# Altium schematic sheet 27. CPLD.SchDoc: CPLD (part 1 of 2)
size 513 x 386 mm; Project: PROC154E2(001)_SK_AM69; Issue: 1.0; RevCode: E3; Page Create Date: March  8, 1995; Variant Name: Core Design; Schematic Page Number: 27; Page Number: 27; Page Size: C; Comment: MISTRAL_TITLEBLK_CSIZE_1; Page Count: 62; Schematic Page Count: 62; Name: PROC154E2 001 SK AM69; DsnPath: C:\Users\danie\Downloads\sprr466c\PROC154E3_RP\PROC154E3_SCH.DSN; SchematicName: SCHEMATIC1; PageName: 27. CPLD; PageSize: C; TopSchematic: True
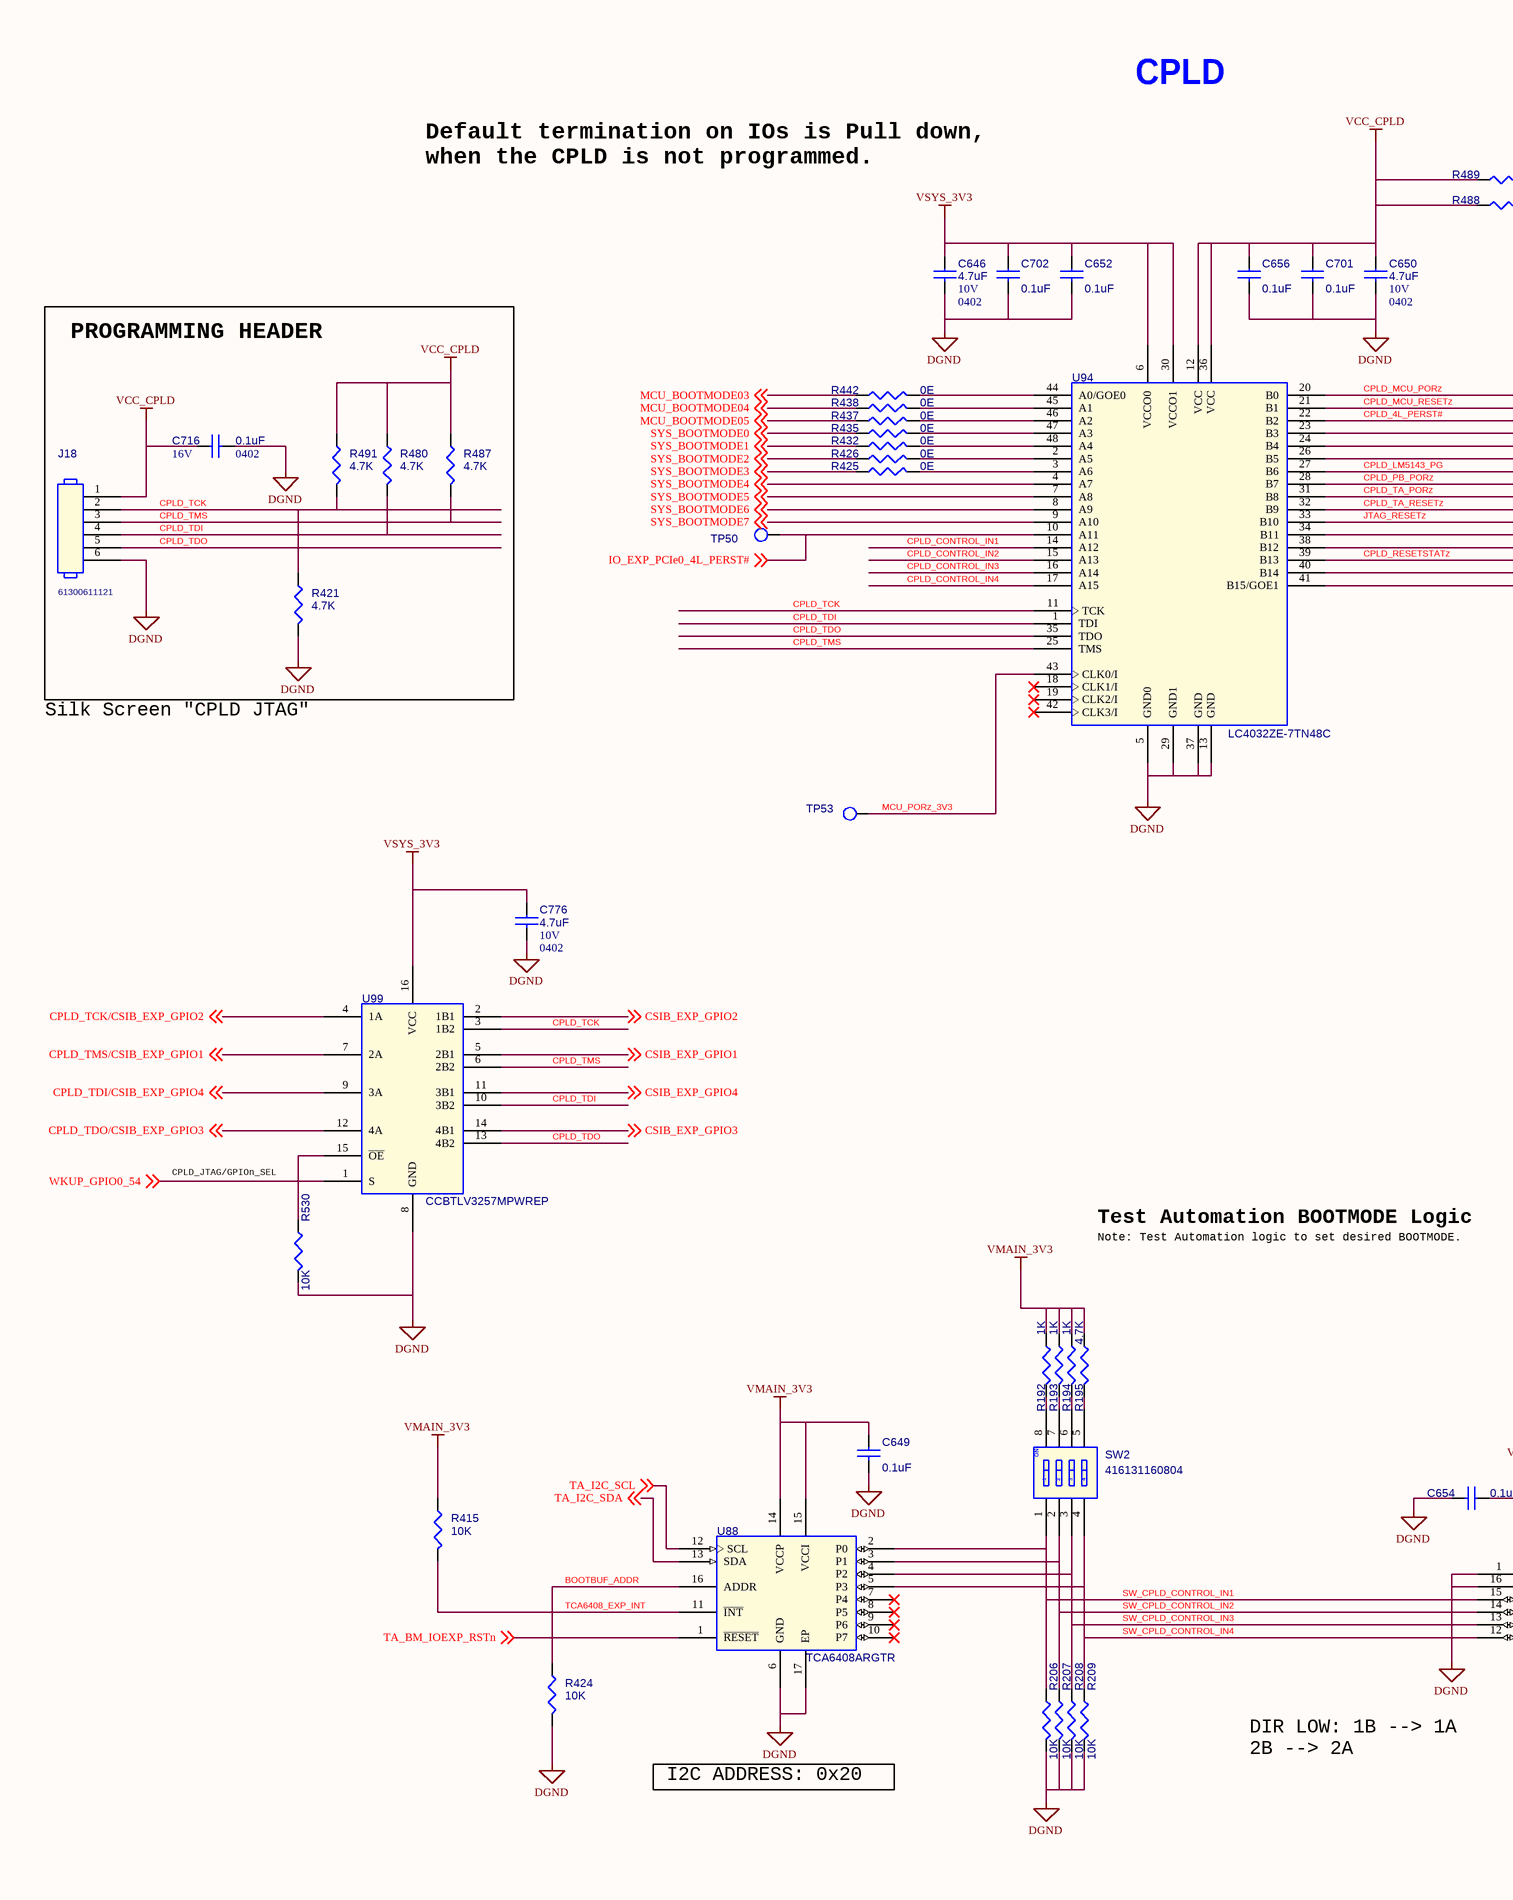
[diagram p0: 27. CPLD.SchDoc, left]
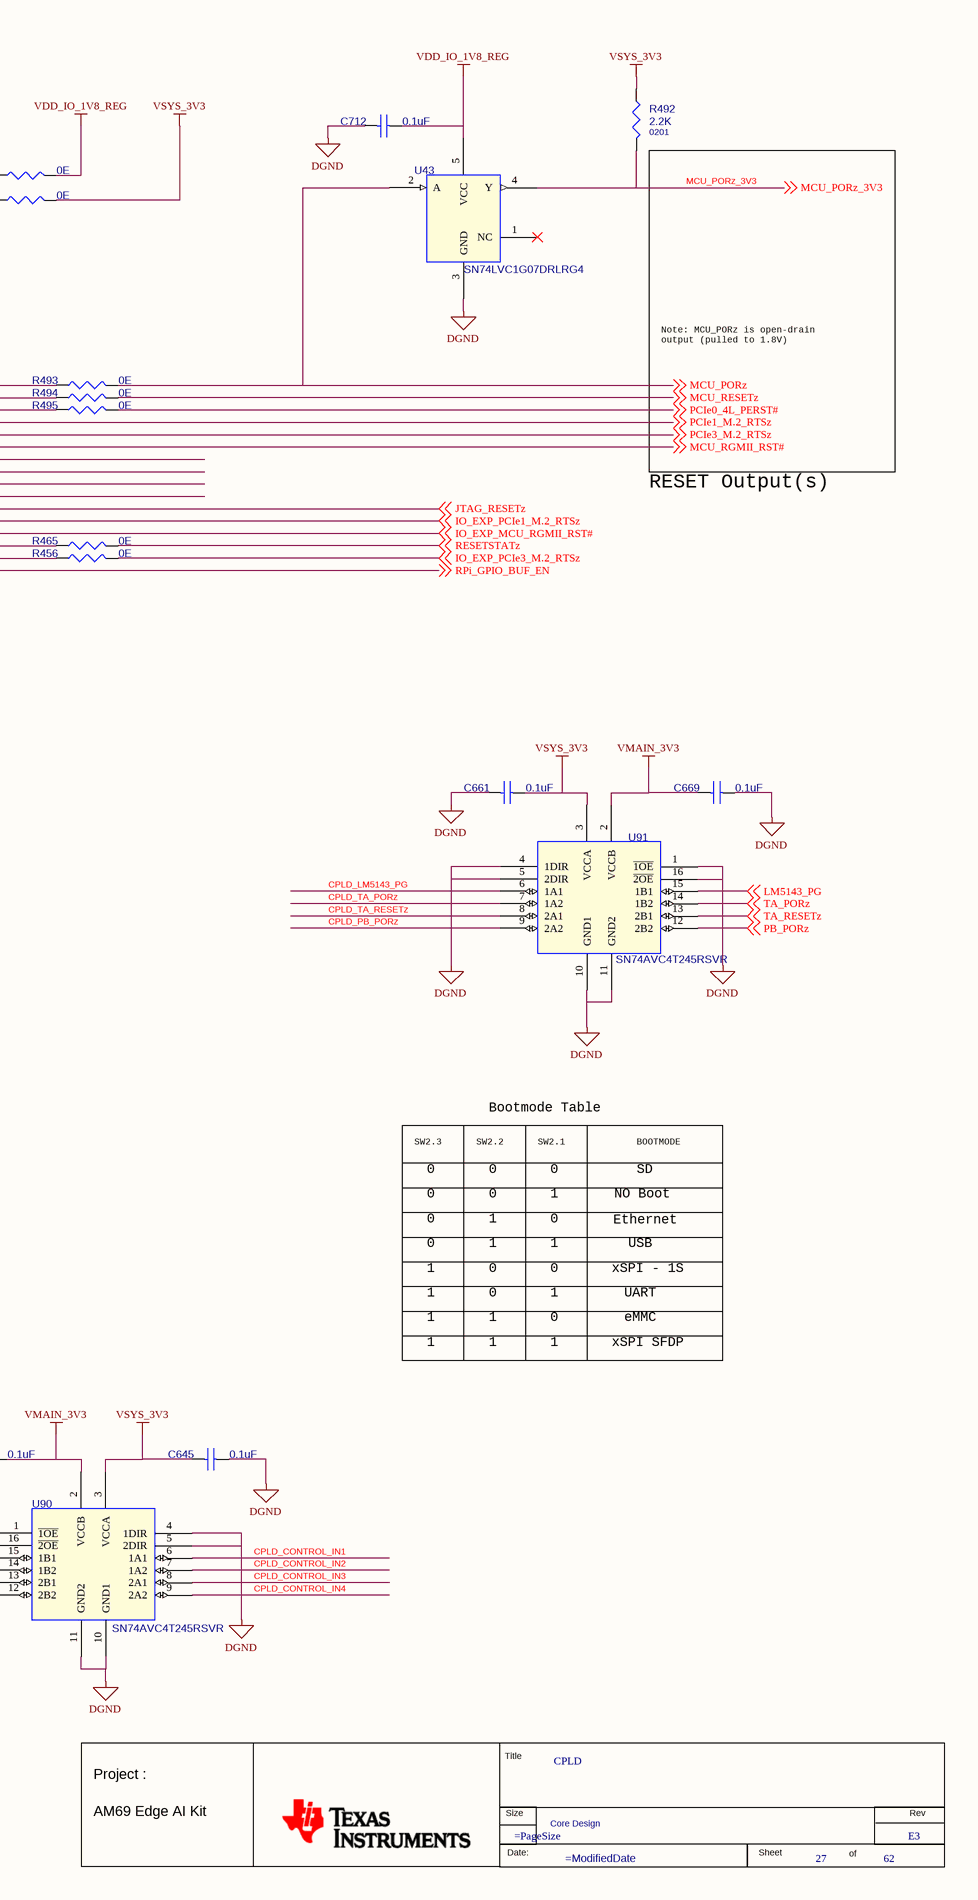
[diagram p1: 27. CPLD.SchDoc, right]

## Parts
*  RevCode: E3  Title: CPLD  Page Number: 27  Page Count: 62  Variant Name: Core Design  (hidden comment: MISTRAL_TITLEBLK_CSIZE_1)  (graphical)
C645  0.1uF  [CAP0201_0-5]
C646  4.7uF  Voltage: 10V  Package: 0402  [CAP0402_0-75]
C649  0.1uF  [CAP0201_0-5]
C650  4.7uF  Package: 0402  Voltage: 10V  [CAP0402_0-75]
C652  0.1uF  [CAP0201_0-5]
C654  0.1uF  [CAP0201_0-5]
C656  0.1uF  [CAP0201_0-5]
C661  0.1uF  [CAP0201_0-5]
C669  0.1uF  [CAP0201_0-5]
C701  0.1uF  [CAP0201_0-5]
C702  0.1uF  [CAP0201_0-5]
C712  0.1uF  [CAP0201_0-5]
C716  0.1uF  Voltage: 16V  Package: 0402  [CAP0402_0-75]
C776  4.7uF  Voltage: 10V  Package: 0402  [CAP0402_0-75]
J18  Mfr_part_number: 61300611121  [HDR_1X6_61300611121_S_T_8-6]  (hidden comment: HDR_1X6)
R192  1K  [RES0201_0-5]
R193  1K  [RES0201_0-5]
R194  1K  [RES0201_0-5]
R195  4.7K  [RES0201_0-5]
R206  10K  [RES0201_0-5]
R207  10K  [RES0201_0-5]
R208  10K  [RES0201_0-5]
R209  10K  [RES0201_0-5]
R415  10K  [RES0201_0-5]
R421  4.7K  [RES0201_0-5]
R424  10K  [RES0201_0-5]
R425  0E  [RES0201_0-5]
R426  0E  [RES0201_0-5]
R432  0E  [RES0201_0-5]
R435  0E  [RES0201_0-5]
R437  0E  [RES0201_0-5]
R438  0E  [RES0201_0-5]
R442  0E  [RES0201_0-5]
R456  0E  [RES0201_0-5]
R465  0E  [RES0201_0-5]
R480  4.7K  [RES0201_0-5]
R487  4.7K  [RES0201_0-5]
R488  0E  [RES0201_0-5]
R489  0E  [RES0201_0-5]
R491  4.7K  [RES0201_0-5]
R492  2.2K  Package: 0201  [RES0201_0-5]
R493  0E  [RES0201_0-5]
R494  0E  [RES0201_0-5]
R495  0E  [RES0201_0-5]
R530  10K  [RES0201_0-5]
SW2  416131160804  [SW6_1P27_8p75x6p0_GDH]
TP50  TP18_SMD  [TP18_SMD]  (value not drawn)
TP53  TP18_SMD  [TP18_SMD]  (value not drawn)
U43  SN74LVC1G07DRLRG4  [SOT553-5_0-6]
U88  TCA6408ARGTR  [QFN16_19-68_120X120_1_EP1-6]
U90  SN74AVC4T245RSVR  [UQFN16_TMUX1574_70X100_0-6]
U91  SN74AVC4T245RSVR  [UQFN16_TMUX1574_70X100_0-6]
U94  LC4032ZE-7TN48C  [LQFP48_19-68_280X280_1-2]
U99  CCBTLV3257MPWREP  [TSSOP16_25-59_205X180_1-2]

## Blocks framed on the sheet
PROGRAMMING HEADER: C716 J18 R421 R480 R487 R491

## Nets
DGND: C645.1 C646.2 C649.2 C650.2 C652.2 C654.2 C656.2 C661.2 C669.1 C701.2 C702.2 C712.2 C716.2 C776.2 J18.6 R206.1 R207.1 R208.1 R209.1 R421.2 R424.1 R530.1 U43.3(GND) U88.6(GND) U88.17(EP) U90.1(~{1OE}) U90.4(1DIR) U90.5(2DIR) U90.10(GND1) U90.11(GND2) U90.16(~{2OE}) U91.1(~{1OE}) U91.4(1DIR) U91.5(2DIR) U91.10(GND1) U91.11(GND2) U91.16(~{2OE}) U94.5(GND0) U94.13(GND) U94.29(GND1) U94.37(GND) U99.8(GND)
VCC_CPLD: C650.1 C656.1 C701.1 C716.1 J18.1 R480.1 R487.1 R488.1 R489.1 R491.1 U94.12(VCC) U94.36(VCC)
VDD_IO_1V8_REG: C712.1 R489.2 U43.5(VCC)
VMAIN_3V3: C649.1 C654.1 C669.2 R192.1 R193.1 R194.1 R195.1 R415.2 U88.14(VCCP) U88.15(VCCI) U90.2(VCCB) U91.2(VCCB)
VSYS_3V3: C645.2 C646.1 C652.1 C661.1 C702.1 C776.1 R488.2 R492.1 U90.3(VCCA) U91.3(VCCA) U94.6(VCCO0) U94.30(VCCO1) U99.16(VCC)
BOOTBUF_ADDR: R424.2 U88.16(ADDR)
CPLD_4L_PERST#: R495.1 U94.22(B2)
CPLD_CONTROL_IN1: U90.6(1A1) U94.14(A12)
CPLD_CONTROL_IN2: U90.7(1A2) U94.15(A13)
CPLD_CONTROL_IN3: U90.8(2A1) U94.16(A14)
CPLD_CONTROL_IN4: U90.9(2A2) U94.17(A15)
CPLD_LM5143_PG: U91.6(1A1) U94.27(B6)
CPLD_MCU_PORz: R493.1 U94.20(B0)
CPLD_MCU_RESETz: R494.1 U94.21(B1)
CPLD_PB_PORz: U91.9(2A2) U94.28(B7)
CPLD_RESETSTATz: R465.1 U94.39(B13)
CPLD_TA_PORz: U91.7(1A2) U94.31(B8)
CPLD_TA_RESETz: U91.8(2A1) U94.32(B9)
CPLD_TCK: J18.2 R421.1 R491.2 U94.11(TCK) U99.3(1B2)
CPLD_TCK/CSIB_EXP_GPIO2: U99.4(1A) ; off-sheet CPLD_TCK/CSIB_EXP_GPIO2
CPLD_TDI: J18.4 R480.2 U94.1(TDI) U99.10(3B2)
CPLD_TDI/CSIB_EXP_GPIO4: U99.9(3A) ; off-sheet CPLD_TDI/CSIB_EXP_GPIO4
CPLD_TDO: J18.5 U94.35(TDO) U99.13(4B2)
CPLD_TDO/CSIB_EXP_GPIO3: U99.12(4A) ; off-sheet CPLD_TDO/CSIB_EXP_GPIO3
CPLD_TMS: J18.3 R487.2 U94.25(TMS) U99.6(2B2)
CPLD_TMS/CSIB_EXP_GPIO1: U99.7(2A) ; off-sheet CPLD_TMS/CSIB_EXP_GPIO1
CSIB_EXP_GPIO1: U99.5(2B1) ; off-sheet CSIB_EXP_GPIO1
CSIB_EXP_GPIO2: U99.2(1B1) ; off-sheet CSIB_EXP_GPIO2
CSIB_EXP_GPIO3: U99.14(4B1) ; off-sheet CSIB_EXP_GPIO3
CSIB_EXP_GPIO4: U99.11(3B1) ; off-sheet CSIB_EXP_GPIO4
IO_EXP_MCU_RGMII_RST#: U94.38(B12) ; off-sheet IO_EXP_MCU_RGMII_RST#
IO_EXP_PCIe0_4L_PERST#: TP50.1(TP) U94.10(A11) ; off-sheet IO_EXP_PCIe0_4L_PERST#
IO_EXP_PCIe1_M.2_RTSz: U94.34(B11) ; off-sheet IO_EXP_PCIe1_M.2_RTSz
IO_EXP_PCIe3_M.2_RTSz: R456.2 ; off-sheet IO_EXP_PCIe3_M.2_RTSz
JTAG_RESETz: U94.33(B10) ; off-sheet JTAG_RESETz
LM5143_PG: U91.15(1B1) ; off-sheet LM5143_PG
MCU_BOOTMODE03: R442.1 ; off-sheet MCU_BOOTMODE03
MCU_BOOTMODE04: R438.1 ; off-sheet MCU_BOOTMODE04
MCU_BOOTMODE05: R437.1 ; off-sheet MCU_BOOTMODE05
MCU_PORz: R493.2 U43.2(A) ; off-sheet MCU_PORz
MCU_PORz_3V3: R492.2 TP53.1(TP) U43.4(Y) U94.43(CLK0/I) ; off-sheet MCU_PORz_3V3
MCU_RESETz: R494.2 ; off-sheet MCU_RESETz
MCU_RGMII_RST#: U94.26(B5) ; off-sheet MCU_RGMII_RST#
PB_PORz: U91.12(2B2) ; off-sheet PB_PORz
PCIe0_4L_PERST#: R495.2 ; off-sheet PCIe0_4L_PERST#
PCIe1_M.2_RTSz: U94.23(B3) ; off-sheet PCIe1_M.2_RTSz
PCIe3_M.2_RTSz: U94.24(B4) ; off-sheet PCIe3_M.2_RTSz
RESETSTATz: R465.2 ; off-sheet RESETSTATz
RPi_GPIO_BUF_EN: U94.41(B15/GOE1) ; off-sheet RPi_GPIO_BUF_EN
SW_CPLD_CONTROL_IN1: R206.2 SW2.1 U88.2(P0) U90.15(1B1)
SW_CPLD_CONTROL_IN2: R207.2 SW2.2 U88.3(P1) U90.14(1B2)
SW_CPLD_CONTROL_IN3: R208.2 SW2.3 U88.4(P2) U90.13(2B1)
SW_CPLD_CONTROL_IN4: R209.2 SW2.4 U88.5(P3) U90.12(2B2)
SYS_BOOTMODE0: R435.1 ; off-sheet SYS_BOOTMODE0
SYS_BOOTMODE1: R432.1 ; off-sheet SYS_BOOTMODE1
SYS_BOOTMODE2: R426.1 ; off-sheet SYS_BOOTMODE2
SYS_BOOTMODE3: R425.1 ; off-sheet SYS_BOOTMODE3
SYS_BOOTMODE4: U94.4(A7) ; off-sheet SYS_BOOTMODE4
SYS_BOOTMODE5: U94.7(A8) ; off-sheet SYS_BOOTMODE5
SYS_BOOTMODE6: U94.8(A9) ; off-sheet SYS_BOOTMODE6
SYS_BOOTMODE7: U94.9(A10) ; off-sheet SYS_BOOTMODE7
TA_BM_IOEXP_RSTn: U88.1(~{RESET}) ; off-sheet TA_BM_IOEXP_RSTn
TA_I2C_SCL: U88.12(SCL) ; off-sheet TA_I2C_SCL
TA_I2C_SDA: U88.13(SDA) ; off-sheet TA_I2C_SDA
TA_PORz: U91.14(1B2) ; off-sheet TA_PORz
TA_RESETz: U91.13(2B1) ; off-sheet TA_RESETz
TCA6408_EXP_INT: R415.1 U88.11(~{INT})
WKUP_GPIO0_54: U99.1(S) ; off-sheet WKUP_GPIO0_54
NetR192_2: R192.2 SW2.8
NetR193_2: R193.2 SW2.7
NetR194_2: R194.2 SW2.6
NetR195_2: R195.2 SW2.5
NetR425_2: R425.2 U94.3(A6)
NetR426_2: R426.2 U94.2(A5)
NetR432_2: R432.2 U94.48(A4)
NetR435_2: R435.2 U94.47(A3)
NetR437_2: R437.2 U94.46(A2)
NetR438_2: R438.2 U94.45(A1)
NetR442_2: R442.2 U94.44(A0/GOE0)
NetR456_1: R456.1 U94.40(B14)
NetR530_2: R530.2 U99.15(~{OE})

Not connected (* = marked no-connect by the designer): U43 1(NC)*; U88 7(P4)* 8(P5)* 9(P6)* 10(P7)*; U94 18(CLK1/I)* 19(CLK2/I)* 42(CLK3/I)*

## Notes on the sheet
- Default termination on IOs is Pull down,
  when the CPLD is not programmed.
- CPLD
- Note: MCU_PORz is open-drain
  output (pulled to 1.8V)
- RESET Output(s)
- Silk Screen "CPLD JTAG"
- CPLD_JTAG/GPIOn_SEL
- SW2.3
- SW2.2
- Bootmode Table
- SW2.1
- BOOTMODE
- Test Automation BOOTMODE Logic
- Note: Test Automation logic to set desired BOOTMODE.
- 0
- 1
- Ethernet
- NO Boot
- SD
- xSPI - 1S
- USB
- xSPI SFDP
- UART
- eMMC
- DIR LOW: 1B --> 1A
  2B --> 2A
- I2C ADDRESS: 0x20
- (in symbol MISTRAL_TITLEBLK_CSIZE_1) Title; Project :; Size; Rev; AM69 Edge AI Kit; Date:; Sheet; of
- (in symbol SW8_GDH04S04) ON